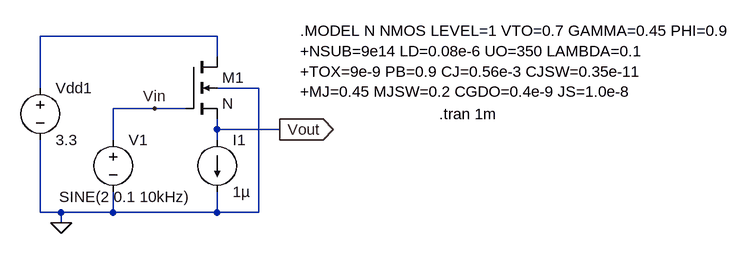
[diagram p0: schematic SourceFollower-TimeDomain.asc]
SourceFollower-TimeDomain.asc, the LTspice schematic file:
Version 4
SHEET 1 880 680
WIRE -192 -16 -464 -16
WIRE -192 16 -192 -16
WIRE -464 64 -464 -16
WIRE -128 64 -192 64
WIRE -288 96 -352 96
WIRE -240 96 -288 96
WIRE -192 128 -192 112
WIRE -96 128 -192 128
WIRE -352 144 -352 96
WIRE -192 144 -192 128
WIRE -464 256 -464 144
WIRE -432 256 -464 256
WIRE -352 256 -352 224
WIRE -352 256 -432 256
WIRE -192 256 -192 224
WIRE -192 256 -352 256
WIRE -128 256 -128 64
WIRE -128 256 -192 256
WIRE -432 272 -432 256
FLAG -432 272 0
FLAG -96 128 Vout
IOPIN -96 128 Out
FLAG -288 96 Vin
SYMBOL nmos4 -240 16 R0
SYMATTR InstName M1
SYMATTR Value N
SYMATTR Value2 l=4u w=1u
SYMBOL voltage -464 48 R0
WINDOW 123 0 0 Left 0
WINDOW 39 0 0 Left 0
SYMATTR InstName Vdd1
SYMATTR Value 3.3
SYMBOL voltage -352 128 R0
WINDOW 123 0 0 Left 0
WINDOW 39 0 0 Left 0
WINDOW 3 -83 104 Left 2
SYMATTR InstName V1
SYMATTR Value SINE(2 0.1 10kHz)
SYMBOL current -192 144 R0
WINDOW 123 0 0 Left 0
WINDOW 39 0 0 Left 0
SYMATTR InstName I1
SYMATTR Value 1µ
TEXT -64 -24 Left 2 !.MODEL N NMOS LEVEL=1 VTO=0.7 GAMMA=0.45 PHI=0.9\n+NSUB=9e14 LD=0.08e-6 UO=350 LAMBDA=0.1\n+TOX=9e-9 PB=0.9 CJ=0.56e-3 CJSW=0.35e-11\n+MJ=0.45 MJSW=0.2 CGDO=0.4e-9 JS=1.0e-8
TEXT 150 104 Left 2 !.tran 1m

The netlist it stands for:
* SourceFollower-TimeDomain.asc
M1 N001 Vin Vout 0 N l=4u w=1u
Vdd1 N001 0 3.3
V1 Vin 0 SINE(2 0.1 10kHz)
I1 Vout 0 1µ
.model NMOS NMOS
.model PMOS PMOS
.lib standard.mos
.MODEL N NMOS LEVEL=1 VTO=0.7 GAMMA=0.45 PHI=0.9
+NSUB=9e14 LD=0.08e-6 UO=350 LAMBDA=0.1
+TOX=9e-9 PB=0.9 CJ=0.56e-3 CJSW=0.35e-11
+MJ=0.45 MJSW=0.2 CGDO=0.4e-9 JS=1.0e-8
.tran 1m
.backanno
.end